# Altium schematic sheet accessory2.SchDoc
size A
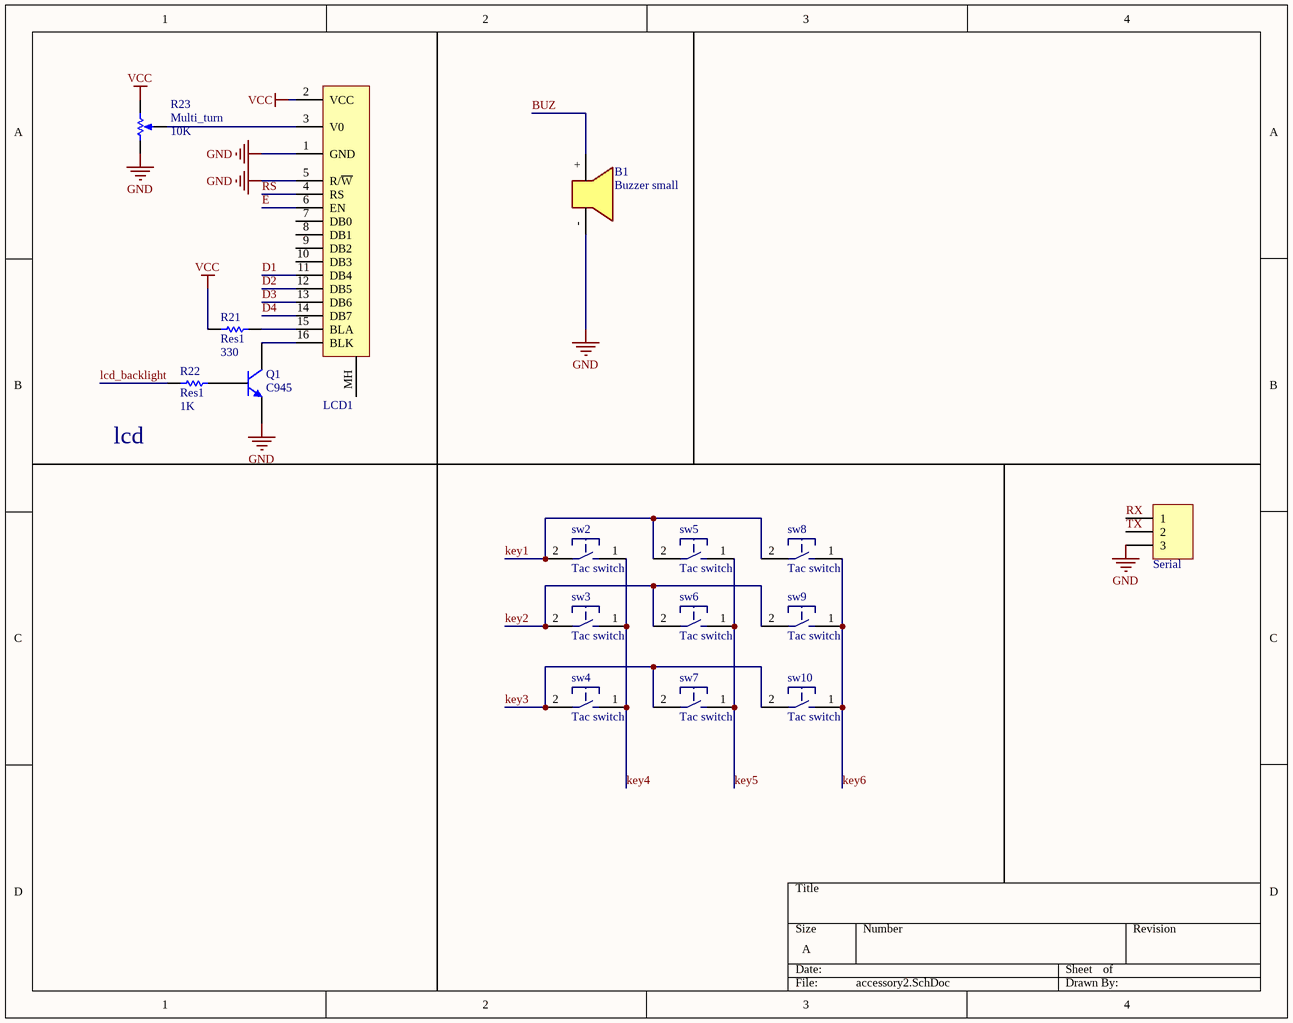
[diagram p0: accessory2.SchDoc]

## Parts
B1  Buzzer small  [My_Buzzer]
LCD1  20x4  [LCD 16x2]  (value not drawn)
Q1  C945  [SOT23_L]
R21  Res1  value 330  [RES 1206/3216]
R22  Res1  value 1K  [RES 1206/3216]
R23  Multi_turn  value 10K  [My_Pot_trim]
Serial  H-1x3  [H-1x3]  (value not drawn)
sw2  Tac switch  [MY_TACTILE-PTH]
sw3  Tac switch  [MY_TACTILE-PTH]
sw4  Tac switch  [MY_TACTILE-PTH]
sw5  Tac switch  [MY_TACTILE-PTH]
sw6  Tac switch  [MY_TACTILE-PTH]
sw7  Tac switch  [MY_TACTILE-PTH]
sw8  Tac switch  [MY_TACTILE-PTH]
sw9  Tac switch  [MY_TACTILE-PTH]
sw10  Tac switch  [MY_TACTILE-PTH]

## Nets
GND: B1.- LCD1.1(GND) LCD1.5(R/~{W}) Q1.1(E) R23.1(TOP) Serial.3
VCC: LCD1.2(VCC) R21.1 R23.2(BOT)
BUZ: B1.+
D1: LCD1.11(DB4)
D2: LCD1.12(DB5)
D3: LCD1.13(DB6)
D4: LCD1.14(DB7)
E: LCD1.6(EN)
key1: sw2.2 sw5.2 sw8.2
key2: sw3.2 sw6.2 sw9.2
key3: sw4.2 sw7.2 sw10.2
key4: sw2.1 sw3.1 sw4.1
key5: sw5.1 sw6.1 sw7.1
key6: sw8.1 sw9.1 sw10.1
lcd_backlight: R22.1
RS: LCD1.4(RS)
RX: Serial.1
TX: Serial.2
NetLCD1_3: LCD1.3(V0) R23.3(TAP)
NetLCD1_15: LCD1.15(BLA) R21.2
NetLCD1_16: LCD1.16(BLK) Q1.2(C)
NetQ1_3: Q1.3(B) R22.2

Not connected (* = marked no-connect by the designer): LCD1 7(DB0) 8(DB1) 9(DB2) 10(DB3) MH

## Notes on the sheet
- (near R22) lcd

## Library data of the parts
B1 = Buzzer: 5-12v small buzzer (12mm)
LCD1 = LCD: Designer: Saeid Jorablo; Company: My self; Adding Date: 10/21/2009; LCDType: 20x4
Q1 = C945: NPN Transistor; pin to pad: 1>2 2>1; Designer: Saeid Jorablo; Company: IPA CO; Last Update Time: 2008/08/04; Value: C945
R21 R22 = Res1: Resistor; Published: 8-Jun-2000; LatestRevisionDate: 17-Jul-2002; LatestRevisionNote: Re-released for DXP Platform.; PackageReference: AXIAL-0.3; Publisher: Altium Limited; PackageDescription: Axial Device, Thru-Hole; 2 Leads; 0.3 in Pin Spacing
R23 = Multi_turn: Potentiometer; Sim Note: Enter the Resistance value and the set point into parameter fields.; Set Position: 0.5; Published: 8-Jun-2000; LatestRevisionDate: 17-Jul-2002; LatestRevisionNote: Re-released for DXP Platform.; PackageReference: VR5; Publisher: Altium Limited
sw2-sw10 = Tac switch: small tac switch